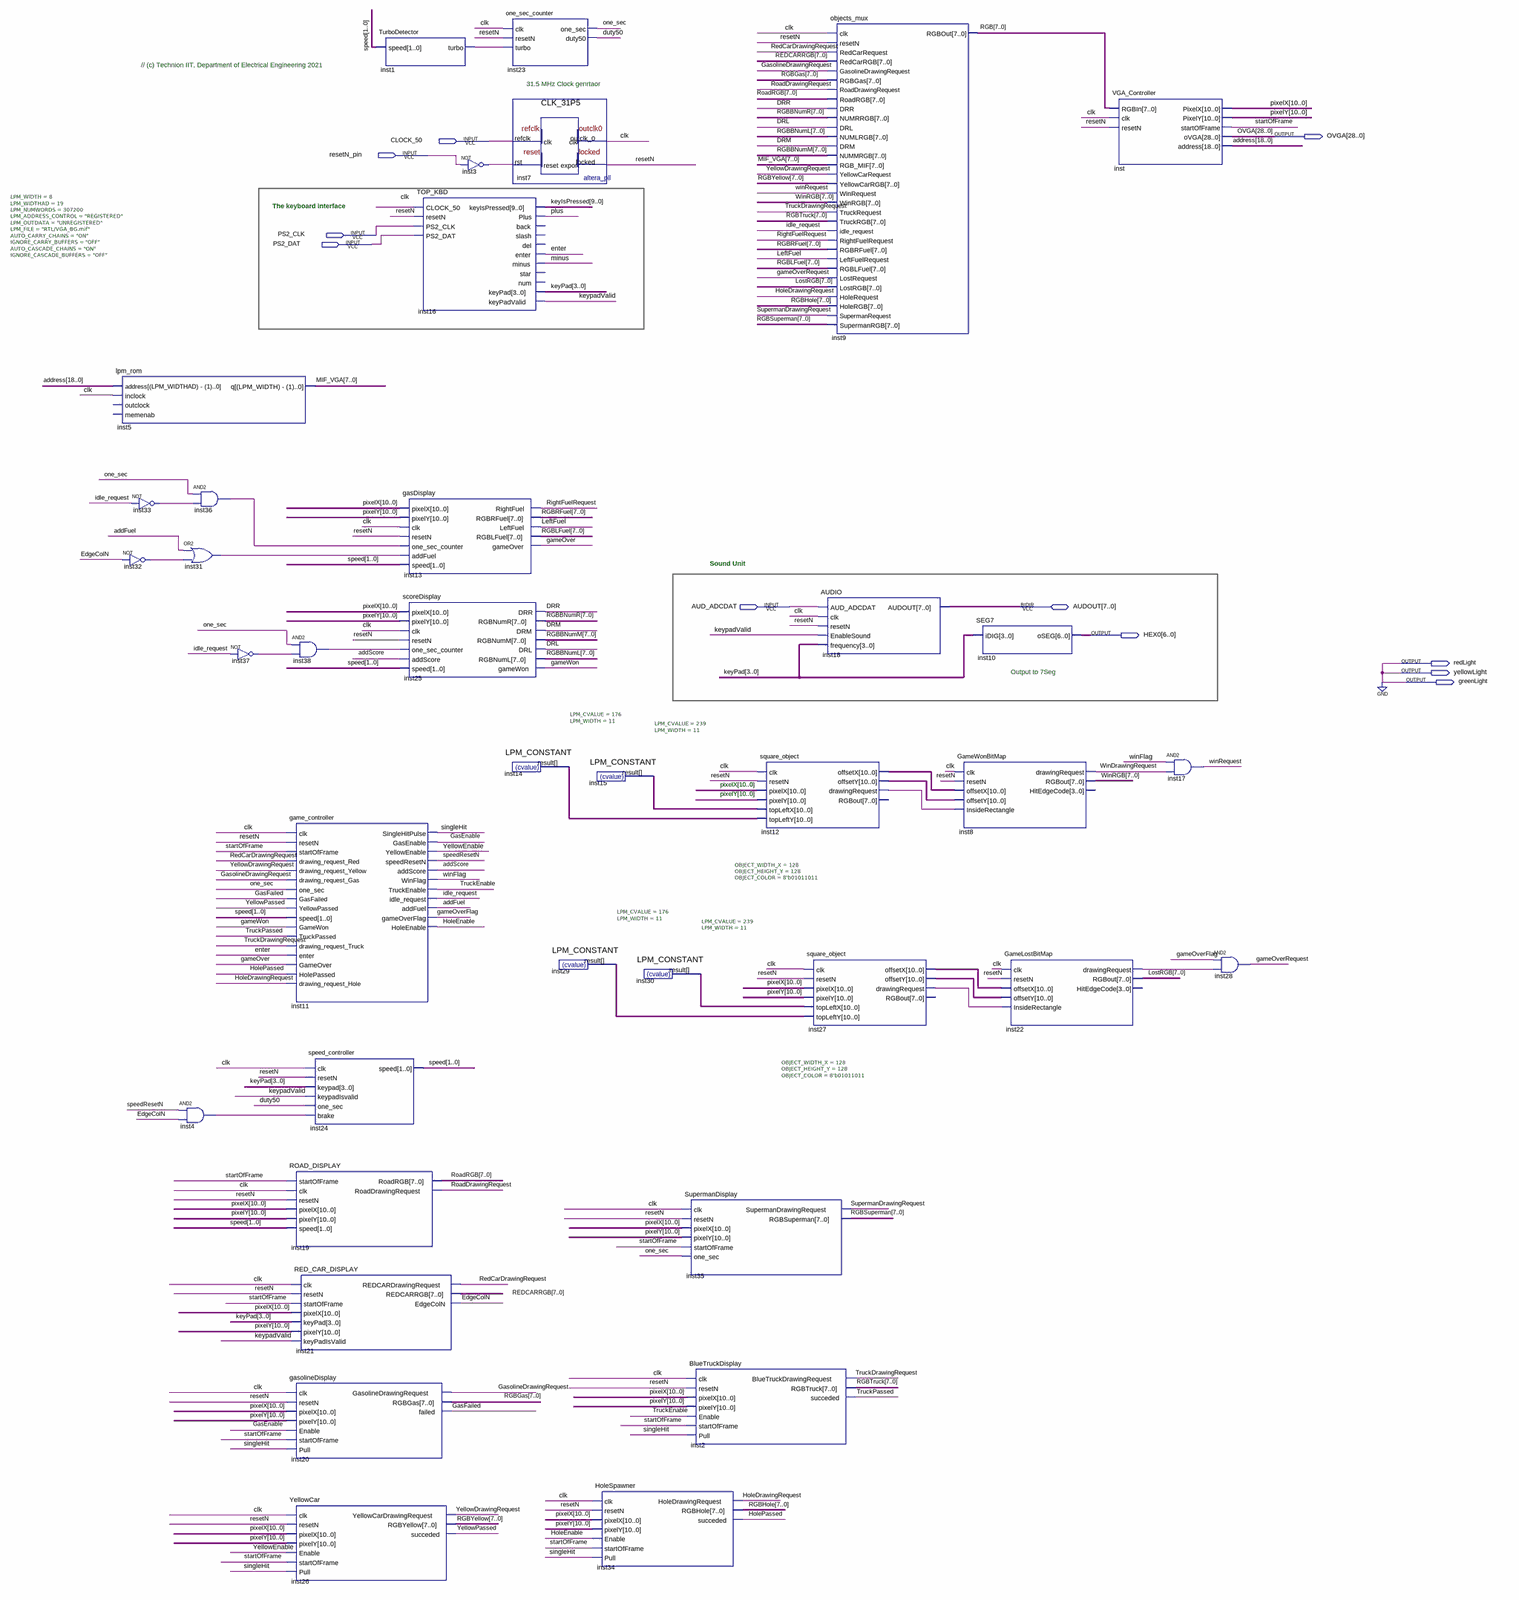
[diagram p0: schematic sheet, whole]
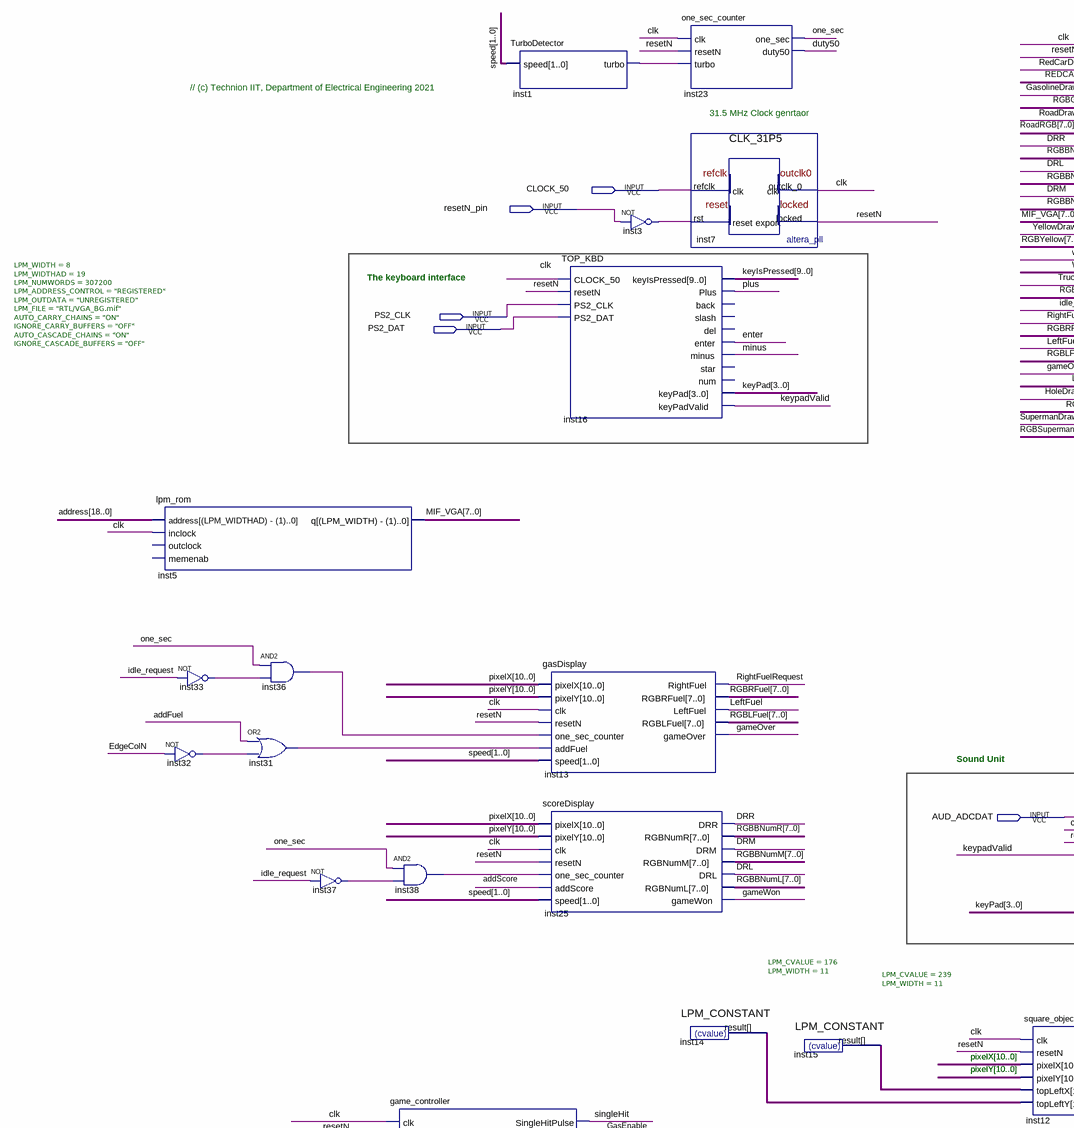
[diagram p1: schematic sheet, upper left part]
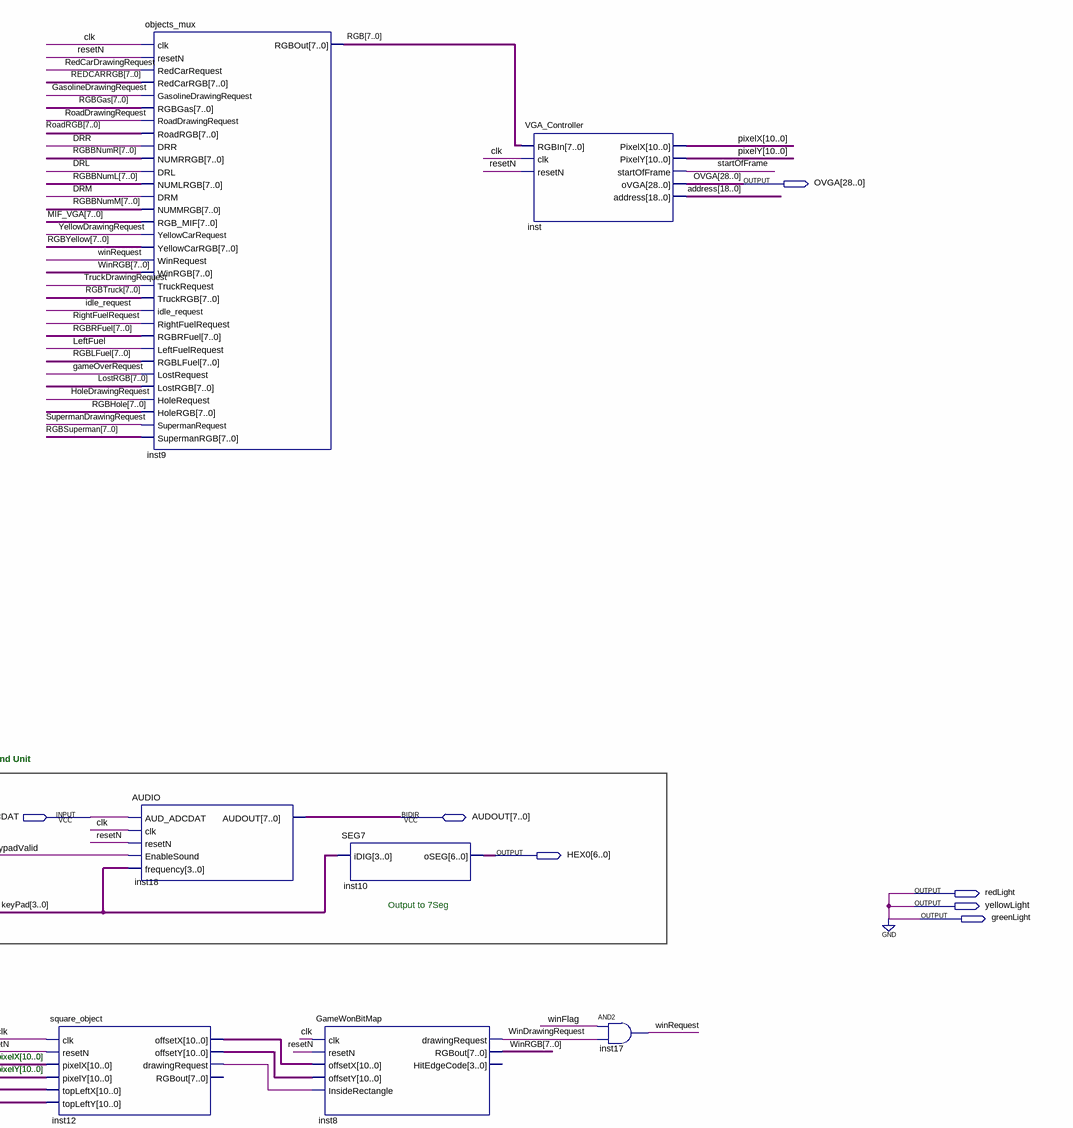
[diagram p2: schematic sheet, upper right part]
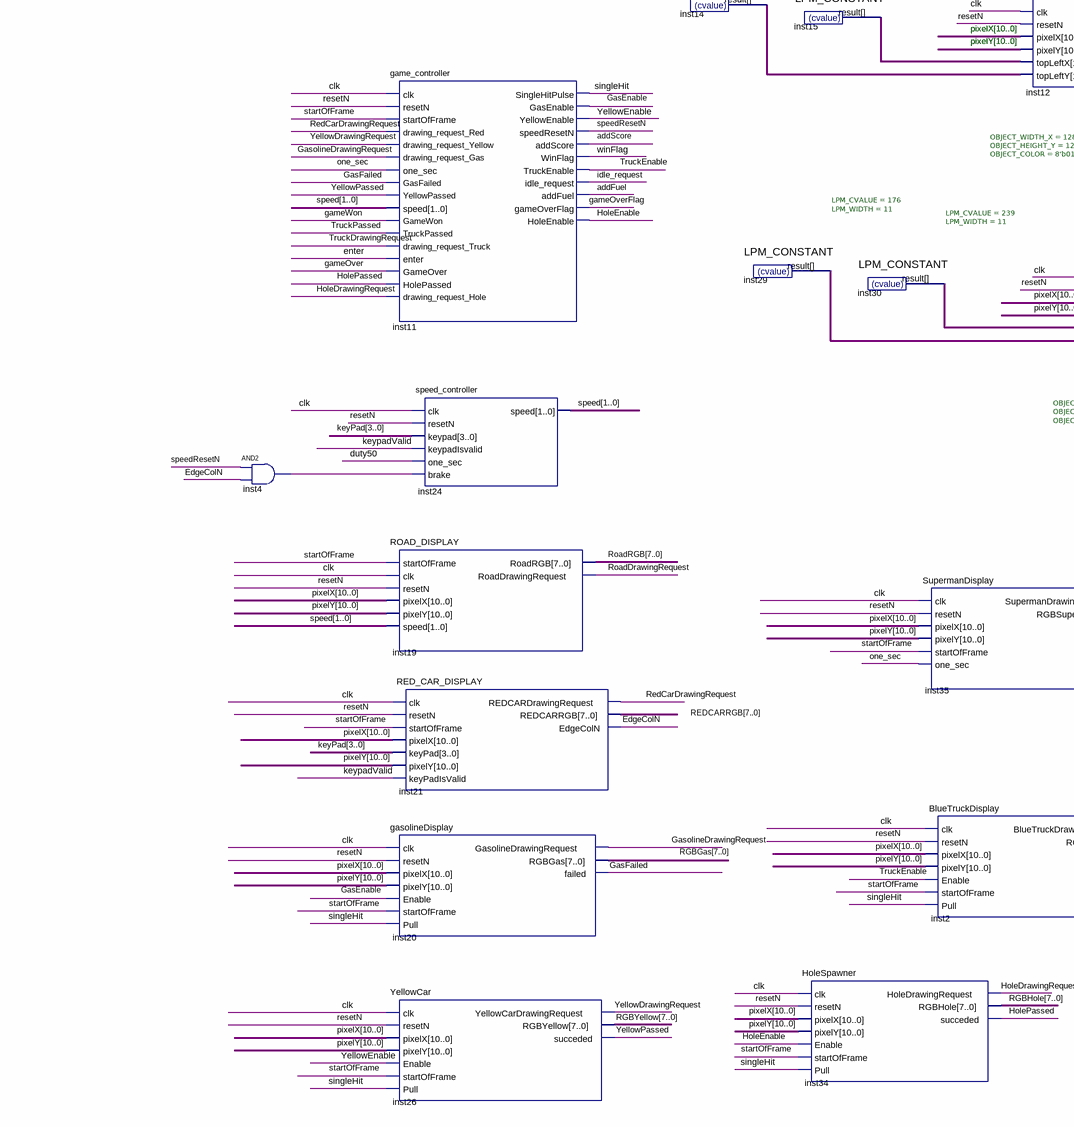
[diagram p3: schematic sheet, lower left part]
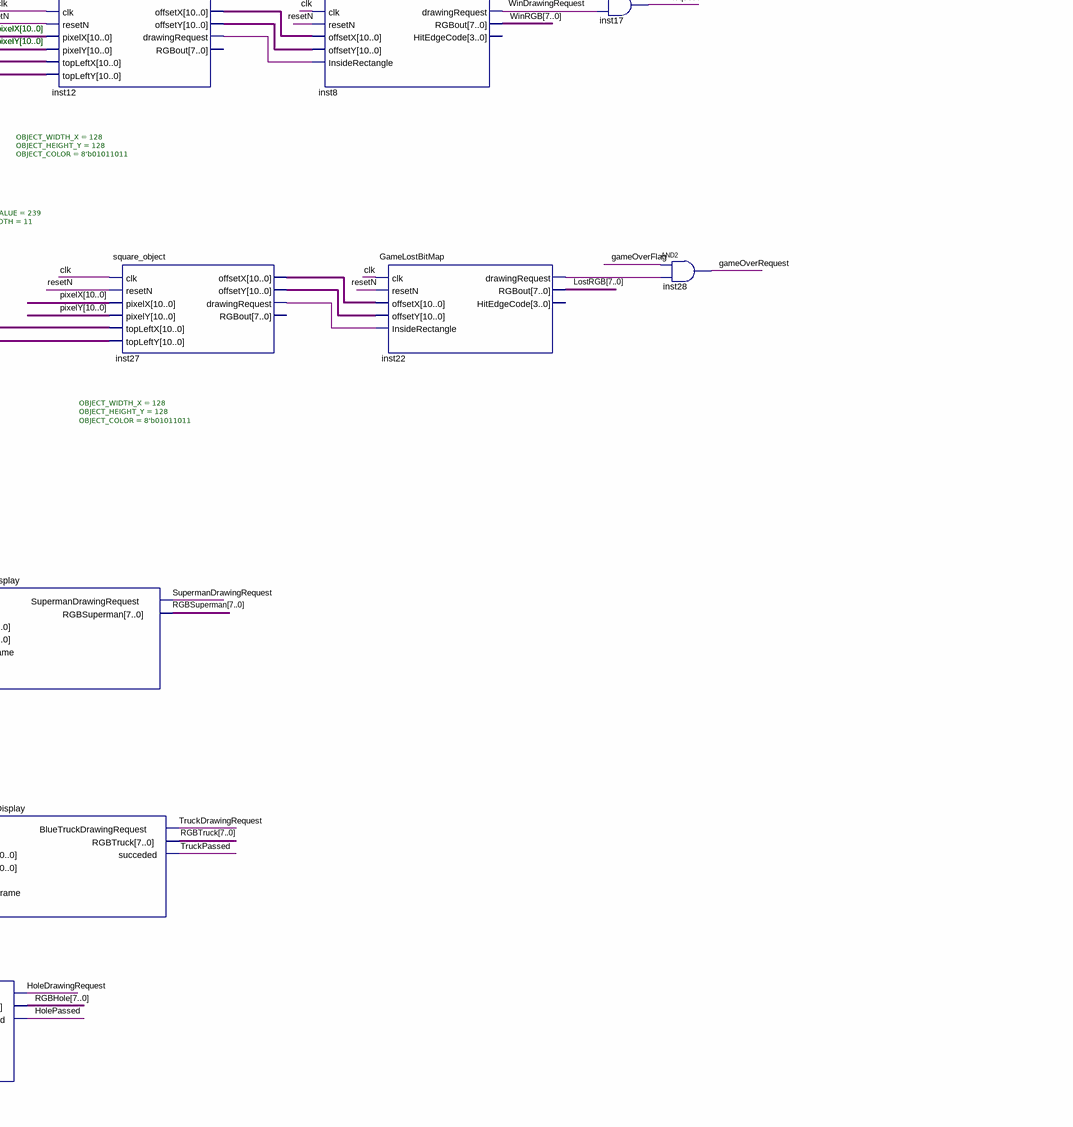
[diagram p4: schematic sheet, lower right part]
// Quartus schematic TOP_VGA_DEMO_KBD.bdf as structural Verilog: 38 symbols, 11 pins
module TOP_VGA_DEMO_KBD (
  input  CLOCK_50,
  input  resetN_pin,
  input  PS2_CLK,
  input  PS2_DAT,
  input  AUD_ADCDAT,
  inout  [7:0] AUDOUT,
  output [28:0] OVGA,
  output [6:0] HEX0,
  output redLight,
  output yellowLight,
  output greenLight
);

  wire addFuel, addScore, clk, DRL, DRM, DRR, duty50, EdgeColN, enter, gameOver, gameOverFlag,
       gameOverRequest, gameWon, GasEnable, GasFailed, GasolineDrawingRequest, HoleDrawingRequest,
       HoleEnable, HolePassed, idle_request, inst1_turbo, inst3_out, inst4_out, inst12_drawingrequest,
       inst22_drawingrequest, inst27_drawingrequest, inst31_out, inst32_out, inst33_out, inst36_out,
       inst37_out, inst38_out, keypadValid, LeftFuel, minus, one_sec, plus, RedCarDrawingRequest, resetN,
       RightFuelRequest, RoadDrawingRequest, singleHit, speedResetN, startOfFrame, SupermanDrawingRequest,
       TruckDrawingRequest, TruckEnable, TruckPassed, WinDrawingRequest, winFlag, winRequest,
       YellowDrawingRequest, YellowEnable, YellowPassed;
  wire [1:0] speed;
  wire [3:0] keyPad;
  wire [7:0] LostRGB, MIF_VGA, REDCARRGB, RGB, RGBBNumL, RGBBNumM, RGBBNumR, RGBGas, RGBHole, RGBLFuel,
       RGBRFuel, RGBSuperman, RGBTruck, RGBYellow, RoadRGB, WinRGB;
  wire [9:0] keyIsPressed;
  wire [10:0] inst12_offsetx, inst12_offsety, inst14_result, inst15_result, inst27_offsetx, inst27_offsety,
       inst29_result, inst30_result, pixelX, pixelY;
  wire [18:0] address;

  lpm_rom #(.LPM_WIDTH(8), .LPM_WIDTHAD(19), .LPM_NUMWORDS(307200), .LPM_ADDRESS_CONTROL("REGISTERED"), .LPM_OUTDATA("UNREGISTERED"), .LPM_FILE("RTL/VGA_BG.mif"), .AUTO_CARRY_CHAINS("ON"), .IGNORE_CARRY_BUFFERS("OFF"), .AUTO_CASCADE_CHAINS("ON"), .IGNORE_CASCADE_BUFFERS("OFF")) inst5 (
    .address(address), .inclock(clk), .q(MIF_VGA));  // open: outclock, memenab
  not inst33 (inst33_out, idle_request);
  not inst32 (inst32_out, EdgeColN);
  and inst36 (inst36_out, one_sec, inst33_out);
  or inst31 (inst31_out, addFuel, inst32_out);
  and inst4 (inst4_out, speedResetN, EdgeColN);
  not inst37 (inst37_out, idle_request);
  and inst38 (inst38_out, one_sec, inst37_out);
  game_controller inst11 (
    .clk(clk), .resetN(resetN), .startOfFrame(startOfFrame), .drawing_request_Red(RedCarDrawingRequest),
    .drawing_request_Yellow(YellowDrawingRequest), .drawing_request_Gas(GasolineDrawingRequest),
    .one_sec(one_sec), .GasFailed(GasFailed), .YellowPassed(YellowPassed), .speed(speed), .GameWon(gameWon),
    .TruckPassed(TruckPassed), .drawing_request_Truck(TruckDrawingRequest), .enter(enter),
    .GameOver(gameOver), .HolePassed(HolePassed), .drawing_request_Hole(HoleDrawingRequest),
    .SingleHitPulse(singleHit), .GasEnable(GasEnable), .YellowEnable(YellowEnable),
    .speedResetN(speedResetN), .addScore(addScore), .WinFlag(winFlag), .TruckEnable(TruckEnable),
    .idle_request(idle_request), .addFuel(addFuel), .gameOverFlag(gameOverFlag), .HoleEnable(HoleEnable));
  speed_controller inst24 (
    .clk(clk), .resetN(resetN), .keypad(keyPad), .keypadIsvalid(keypadValid), .one_sec(duty50),
    .brake(inst4_out), .speed(speed));
  ROAD_DISPLAY inst19 (
    .startOfFrame(startOfFrame), .clk(clk), .resetN(resetN), .pixelX(pixelX), .pixelY(pixelY), .speed(speed),
    .RoadRGB(RoadRGB), .RoadDrawingRequest(RoadDrawingRequest));
  RED_CAR_DISPLAY inst21 (
    .clk(clk), .resetN(resetN), .startOfFrame(startOfFrame), .pixelX(pixelX), .keyPad(keyPad),
    .pixelY(pixelY), .keyPadIsValid(keypadValid), .REDCARDrawingRequest(RedCarDrawingRequest),
    .REDCARRGB(REDCARRGB), .EdgeColN(EdgeColN));
  gasolineDisplay inst20 (
    .clk(clk), .resetN(resetN), .pixelX(pixelX), .pixelY(pixelY), .Enable(GasEnable),
    .startOfFrame(startOfFrame), .Pull(singleHit), .GasolineDrawingRequest(GasolineDrawingRequest),
    .RGBGas(RGBGas), .failed(GasFailed));
  YellowCar inst26 (
    .clk(clk), .resetN(resetN), .pixelX(pixelX), .pixelY(pixelY), .Enable(YellowEnable),
    .startOfFrame(startOfFrame), .Pull(singleHit), .YellowCarDrawingRequest(YellowDrawingRequest),
    .RGBYellow(RGBYellow), .succeded(YellowPassed));
  TurboDetector inst1 (.speed(speed), .turbo(inst1_turbo));
  TOP_KBD inst16 (
    .CLOCK_50(clk), .resetN(resetN), .PS2_CLK(PS2_CLK), .PS2_DAT(PS2_DAT), .keyIsPressed(keyIsPressed),
    .Plus(plus), .enter(enter), .minus(minus), .keyPad(keyPad), .keyPadValid(keypadValid));  // open: back, slash, del, star, num
  gasDisplay inst13 (
    .pixelX(pixelX), .pixelY(pixelY), .clk(clk), .resetN(resetN), .one_sec_counter(inst36_out),
    .addFuel(inst31_out), .speed(speed), .RightFuel(RightFuelRequest), .RGBRFuel(RGBRFuel),
    .LeftFuel(LeftFuel), .RGBLFuel(RGBLFuel), .gameOver(gameOver));
  scoreDisplay inst25 (
    .pixelX(pixelX), .pixelY(pixelY), .clk(clk), .resetN(resetN), .one_sec_counter(inst38_out),
    .addScore(addScore), .speed(speed), .DRR(DRR), .RGBNumR(RGBBNumR), .DRM(DRM), .RGBNumM(RGBBNumM),
    .DRL(DRL), .RGBNumL(RGBBNumL), .gameWon(gameWon));
  not inst3 (inst3_out, resetN_pin);
  one_sec_counter inst23 (.clk(clk), .resetN(resetN), .turbo(inst1_turbo), .one_sec(one_sec), .duty50(duty50));
  LPM_CONSTANT #(.LPM_CVALUE(176), .LPM_WIDTH(11)) inst14 (.result(inst14_result));
  CLK_31P5 inst7 (.refclk(CLOCK_50), .rst(inst3_out), .outclk_0(clk), .locked(resetN));
  LPM_CONSTANT #(.LPM_CVALUE(176), .LPM_WIDTH(11)) inst29 (.result(inst29_result));
  LPM_CONSTANT #(.LPM_CVALUE(239), .LPM_WIDTH(11)) inst15 (.result(inst15_result));
  HoleSpawner inst34 (
    .clk(clk), .resetN(resetN), .pixelX(pixelX), .pixelY(pixelY), .Enable(HoleEnable),
    .startOfFrame(startOfFrame), .Pull(singleHit), .HoleDrawingRequest(HoleDrawingRequest),
    .RGBHole(RGBHole), .succeded(HolePassed));
  LPM_CONSTANT #(.LPM_CVALUE(239), .LPM_WIDTH(11)) inst30 (.result(inst30_result));
  SupermanDisplay inst35 (
    .clk(clk), .resetN(resetN), .pixelX(pixelX), .pixelY(pixelY), .startOfFrame(startOfFrame),
    .one_sec(one_sec), .SupermanDrawingRequest(SupermanDrawingRequest), .RGBSuperman(RGBSuperman));
  BlueTruckDisplay inst2 (
    .clk(clk), .resetN(resetN), .pixelX(pixelX), .pixelY(pixelY), .Enable(TruckEnable),
    .startOfFrame(startOfFrame), .Pull(singleHit), .BlueTruckDrawingRequest(TruckDrawingRequest),
    .RGBTruck(RGBTruck), .succeded(TruckPassed));
  square_object #(.OBJECT_WIDTH_X(128), .OBJECT_HEIGHT_Y(128), .OBJECT_COLOR(8'b01011011)) inst12 (
    .clk(clk), .resetN(resetN), .pixelX(pixelX), .pixelY(pixelY), .topLeftX(inst15_result),
    .topLeftY(inst14_result), .offsetX(inst12_offsetx), .offsetY(inst12_offsety),
    .drawingRequest(inst12_drawingrequest));  // open: RGBout
  square_object #(.OBJECT_WIDTH_X(128), .OBJECT_HEIGHT_Y(128), .OBJECT_COLOR(8'b01011011)) inst27 (
    .clk(clk), .resetN(resetN), .pixelX(pixelX), .pixelY(pixelY), .topLeftX(inst30_result),
    .topLeftY(inst29_result), .offsetX(inst27_offsetx), .offsetY(inst27_offsety),
    .drawingRequest(inst27_drawingrequest));  // open: RGBout
  objects_mux inst9 (
    .clk(clk), .resetN(resetN), .RedCarRequest(RedCarDrawingRequest), .RedCarRGB(REDCARRGB),
    .GasolineDrawingRequest(GasolineDrawingRequest), .RGBGas(RGBGas),
    .RoadDrawingRequest(RoadDrawingRequest), .RoadRGB(RoadRGB), .DRR(DRR), .NUMRRGB(RGBBNumR), .DRL(DRL),
    .NUMLRGB(RGBBNumL), .DRM(DRM), .NUMMRGB(RGBBNumM), .RGB_MIF(MIF_VGA),
    .YellowCarRequest(YellowDrawingRequest), .YellowCarRGB(RGBYellow), .WinRequest(winRequest),
    .WinRGB(WinRGB), .TruckRequest(TruckDrawingRequest), .TruckRGB(RGBTruck), .idle_request(idle_request),
    .RightFuelRequest(RightFuelRequest), .RGBRFuel(RGBRFuel), .LeftFuelRequest(LeftFuel),
    .RGBLFuel(RGBLFuel), .LostRequest(gameOverRequest), .LostRGB(LostRGB), .HoleRequest(HoleDrawingRequest),
    .HoleRGB(RGBHole), .SupermanRequest(SupermanDrawingRequest), .SupermanRGB(RGBSuperman), .RGBOut(RGB));
  AUDIO inst18 (
    .AUD_ADCDAT(AUD_ADCDAT), .clk(clk), .resetN(resetN), .EnableSound(keypadValid), .frequency(keyPad),
    .AUDOUT(AUDOUT));
  GameWonBitMap inst8 (
    .clk(clk), .resetN(resetN), .offsetX(inst12_offsetx), .offsetY(inst12_offsety),
    .InsideRectangle(inst12_drawingrequest), .drawingRequest(WinDrawingRequest), .RGBout(WinRGB));  // open: HitEdgeCode
  SEG7 inst10 (.iDIG(keyPad), .oSEG(HEX0));
  GameLostBitMap inst22 (
    .clk(clk), .resetN(resetN), .offsetX(inst27_offsetx), .offsetY(inst27_offsety),
    .InsideRectangle(inst27_drawingrequest), .drawingRequest(inst22_drawingrequest), .RGBout(LostRGB));  // open: HitEdgeCode
  VGA_Controller inst (
    .RGBIn(RGB), .clk(clk), .resetN(resetN), .PixelX(pixelX), .PixelY(pixelY), .startOfFrame(startOfFrame),
    .oVGA(OVGA), .address(address));
  and inst17 (winRequest, winFlag, WinDrawingRequest);
  and inst28 (gameOverRequest, gameOverFlag, inst22_drawingrequest);

  assign greenLight = 1'b0;
  assign redLight = 1'b0;
  assign yellowLight = 1'b0;

  // Notes on the sheet:
  //   // (c) Technion IIT, Department of Electrical Engineering 2021
  //   31.5 MHz Clock genrtaor
  //   The keyboard interface
  //   Sound Unit
  //   Output to 7Seg
  //   pixelX[10..0]
  //   pixelY[10..0]
endmodule
